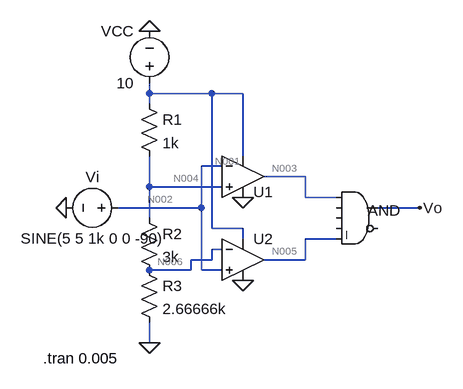
[diagram p0: schematic Draft1.asc]
Draft1.asc, the LTspice schematic file:
Version 4
SHEET 1 880 680
WIRE 48 64 48 48
WIRE 144 64 48 64
WIRE 192 64 144 64
WIRE 48 80 48 64
WIRE 192 160 192 64
WIRE 160 176 128 176
WIRE 288 192 224 192
WIRE 48 208 48 160
WIRE 160 208 48 208
WIRE 288 224 288 192
WIRE 336 224 288 224
WIRE 128 240 128 176
WIRE 128 240 0 240
WIRE 464 240 400 240
WIRE 48 256 48 208
WIRE 144 272 144 64
WIRE 192 272 144 272
WIRE 192 288 192 272
WIRE 336 288 288 288
WIRE 160 304 144 304
WIRE 144 320 144 304
WIRE 144 320 112 320
WIRE 288 320 288 288
WIRE 288 320 224 320
WIRE 112 336 112 320
WIRE 112 336 48 336
WIRE 128 336 128 240
WIRE 160 336 128 336
WIRE 48 448 48 416
FLAG 192 224 0
FLAG 192 352 0
FLAG -80 240 0
FLAG 48 448 0
FLAG 48 -32 0
FLAG 464 240 Vo
SYMBOL OpAmps\\UniversalOpamp2 192 192 R0
WINDOW 0 16 24 Left 2
SYMATTR InstName U1
SYMATTR Value2 Avol=1Meg GBW=1T Slew=1T
SYMBOL OpAmps\\UniversalOpamp2 192 320 R0
SYMATTR InstName U2
SYMATTR Value2 Avol=1Meg GBW=1T Slew=1T
SYMBOL voltage 16 240 R90
WINDOW 0 -32 56 VBottom 2
WINDOW 3 32 56 VTop 2
WINDOW 123 0 0 Left 0
WINDOW 39 0 0 Left 0
SYMATTR InstName Vi
SYMATTR Value SINE(5 5 1k 0 0 -90)
SYMBOL res 32 64 R0
SYMATTR InstName R1
SYMATTR Value 1k
SYMBOL res 32 240 R0
SYMATTR InstName R2
SYMATTR Value 3k
SYMBOL res 32 320 R0
SYMATTR InstName R3
SYMATTR Value 2.66666k
SYMBOL voltage 48 64 R180
WINDOW 0 24 96 Left 2
WINDOW 3 24 16 Left 2
WINDOW 123 0 0 Left 0
WINDOW 39 0 0 Left 0
SYMATTR InstName VCC
SYMATTR Value 10
SYMBOL Digital\\and 368 192 R0
WINDOW 0 16 24 Invisible 2
WINDOW 38 16 52 Left 2
SYMATTR InstName A1
SYMATTR Value2 Vhigh=10, Vlow=0, Ref=1
TEXT -116 472 Left 2 !.tran 0.005

The netlist it stands for:
* Draft1.asc
XU1 N004 N002 N001 0 N003 level.2 Avol=1Meg GBW=1T Slew=1T ilimit=25m rail=0 Vos=0 phimargin=45 en=0 enk=0 in=0 ink=0 Rin=500Meg  ; pins IN+ IN- V+ V- OUT
XU2 N002 N006 N001 0 N005 level.2 Avol=1Meg GBW=1T Slew=1T ilimit=25m rail=0 Vos=0 phimargin=45 en=0 enk=0 in=0 ink=0 Rin=500Meg  ; pins IN+ IN- V+ V- OUT
Vi N002 0 SINE(5 5 1k 0 0 -90)
R1 N001 N004 1k
R2 N004 N006 3k
R3 N006 0 2.66666k
VCC N001 0 10
A1 N003 0 0 0 N005 0 Vo 0 AND Vhigh=10, Vlow=0, Ref=1
.tran 0.005
.lib UniversalOpamps2.sub
.backanno
.end

* Results of the author's LTspice run, read from the files saved beside the schematic
* Operating Point, zero values left out:
*   V(n003) = 10 V
*   V(n001) = 10 V
*   V(n004) = 8.5 V
*   V(n005) = 10.73 µV
*   V(n006) = 4 V
*   I(R3) = 1.5 mA
*   I(R2) = 1.5 mA
*   I(R1) = 1.5 mA
*   I(Vcc) = -1.502 mA
*   I(Vi) = 20 nA
*   Ix(u1:1) = 7 nA
*   Ix(u1:2) = -10 nA
*   Ix(u1:3) = 984.6 nA
*   Ix(u1:4) = -1.157 µA
*   Ix(u2:1) = -10 nA
*   Ix(u2:2) = -2 nA
*   Ix(u2:3) = 1.164 µA
*   Ix(u2:4) = -977.1 nA
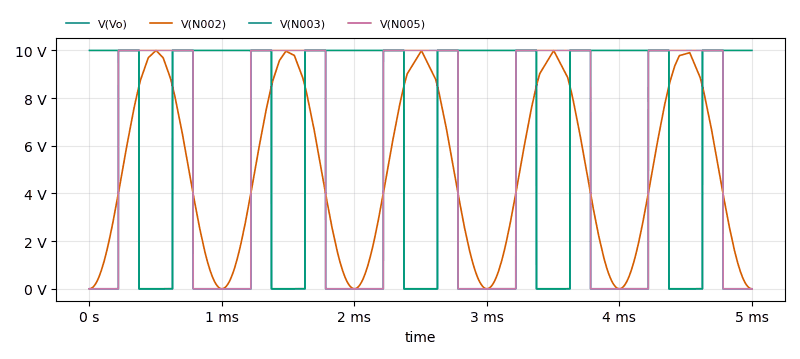
[diagram p1: Transient Analysis of Draft1.asc, plotted from the saved traces]
* Transient Analysis, 1 run:
*   V(Vo): min 0 V, max 10 V, average 3.109 V, rms 5.576 V, last 0 V
*   V(N002): min 0 V, max 9.999 V, average 4.976 V, rms 6.097 V, last 0 V
*   V(N003): min 6.15 µV, max 10 V, average 7.468 V, rms 8.642 V, last 10 V
*   V(N005): min 10.55 µV, max 10 V, average 5.641 V, rms 7.511 V, last 10.73 µV